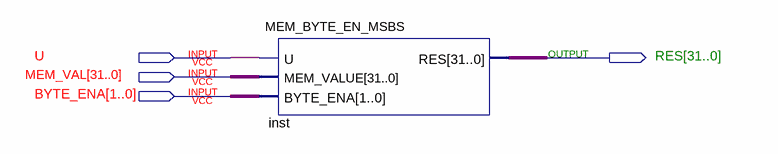
[diagram p0: schematic sheet]
// Quartus schematic MEM_BYTE_EN_MSBSTEST.bdf as structural Verilog: 1 symbols, 4 pins
module MEM_BYTE_EN_MSBSTEST (
  input  U,
  input  [31:0] MEM_VAL,
  input  [1:0] BYTE_ENA,
  output [31:0] RES
);

  MEM_BYTE_EN_MSBS inst (.U(U), .MEM_VALUE(MEM_VAL), .BYTE_ENA(BYTE_ENA), .RES(RES));
endmodule
